# EasyEDA Pro project LUME_PEN_EasyEDA_Project_V1.2_2026-06-28.epro, board Charger_PCB
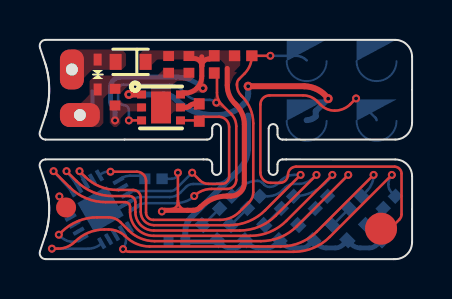
[diagram p5: board, top side]
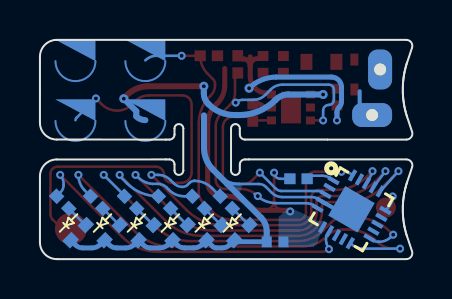
[diagram p6: board, bottom side, seen from below]

Outline 18.64 x 11 mm; copper layers: Top Layer, Bottom Layer. Coordinates in mm from the lower left corner of the outline.
Outline path: 0,4.61 arc(0.04,4.88) 0.28,5 8.37,5 arc(8.55,4.93) 8.63,4.75 8.63,4.44 arc(8.85,4.22) 9.07,4.44 9.07,6.55 arc(8.85,6.77) 8.63,6.55 8.63,6.25 arc(8.55,6.07) 8.37,6 0.28,6 arc(0.04,6.12) 0,6.39 0.25,7.15 0.27,7.2 0.29,7.25 0.3,7.31 0.32,7.36 0.33,7.41 0.34,7.47 0.36,7.52 0.37,7.58 0.38,7.63 0.39,7.69 0.4,7.74 0.41,7.8 0.43,7.91 0.43,7.97 0.44,8.02 0.45,8.08 0.45,8.14 0.45,8.19 0.46,8.25 0.46,8.3 0.46,8.36 0.46,8.42 0.47,8.47 0.47,8.53 0.46,8.59 0.46,8.64 0.46,8.7 0.46,8.75 0.45,8.81 0.45,8.87 0.45,8.92 0.44,8.98 0.43,9.03 0.43,9.09 0.41,9.2 0.4,9.26 0.39,9.31 0.38,9.37 0.37,9.42 0.36,9.48 0.34,9.53 0.33,9.59 0.32,9.64 0.3,9.7 0.29,9.75 0.27,9.8 0.25,9.86 0,10.6 arc(0.04,10.87) 0.29,11 17.8,11 arc(18.4,10.75) 18.64,10.15 18.64,6.84 arc(18.4,6.24) 17.8,6 12.34,6 12.16,6 arc(11.98,6.07) 11.9,6.25 11.9,6.55 arc(11.68,6.77) 11.46,6.55 11.46,4.44 arc(11.68,4.22) 11.9,4.44 11.9,4.75 arc(11.98,4.93) 12.16,5 12.34,5 17.8,5 arc(18.39,4.75) 18.64,4.15 18.64,0.85 arc(18.4,0.25) 17.8,0 17.72,0 0.29,0 arc(0.05,0.12) 0,0.39 0.25,1.14 0.27,1.19 0.29,1.25 0.3,1.3 0.32,1.35 0.33,1.41 0.34,1.46 0.36,1.52 0.37,1.57 0.38,1.63 0.39,1.68 0.4,1.74 0.41,1.79 0.43,1.91 0.43,1.96 0.44,2.02 0.45,2.07 0.45,2.13 0.45,2.19 0.46,2.24 0.46,2.3 0.46,2.35 0.46,2.41 0.47,2.47 0.47,2.52 0.46,2.58 0.46,2.63 0.46,2.69 0.46,2.75 0.45,2.8 0.45,2.86 0.45,2.91 0.44,2.97 0.43,3.03 0.43,3.08 0.41,3.19 0.4,3.25 0.39,3.31 0.38,3.36 0.37,3.42 0.36,3.47 0.34,3.53 0.33,3.58 0.32,3.64 0.3,3.69 0.29,3.74 0.27,3.8 0.25,3.85 0,4.61
Stack: Top Layer 0.035mm / Dielectric1 1.51mm FR4 er 4.5 / Bottom Layer 0.035mm

## Design rules (mm)
template: Custom Config
spacing copperThickness1oz (default): track to track 0.102, other pairs 0.13 to 0.3
spacing copperThickness2oz: track to track 0.203, other pairs 0.152 to 0.3
track width copperThickness1oz (default): min 0.127, default 0.127, max 2.54
track width copperThickness2oz: min 0.203, default 0.254, max 2.54
differential pair differentialPair (default): width min 0.127, default 0.254, max 2.54; gap min 0.152, default 0.152
via viaSize (default): diameter min 0.5, default 0.61, max 10; hole min 0.3, default 0.305, max 6.3

## Placement (name value [footprint] x y rotation side)
C1  100nF  [C0402]  7.46 9.77 270 top
C2  10µF  [C0402]  6.45 9.77 270 top
C3  100nF  [C0402]  6.86 0.87 0 bottom
C4  100nF  [C0402]  3.76 8.13 90 top
D3  RB520SM-40T2R  [SOD-523F_L1.7-W0.9-LS1.7-RD]  4.54 9.89 180 top
LED1  XL-1005URC  [LED0402-RD_YELLOW]  8.53 1.33 135 bottom
LED2  XL-1005UWC  [LED0402-RD_YELLOW]  9.92 1.33 135 bottom
LED3  XL-1005UWC  [LED0402-RD_YELLOW]  11.62 1.33 135 bottom
LED4  XL-1005UWC  [LED0402-RD_YELLOW]  13.32 1.33 135 bottom
LED5  XL-1005UWC  [LED0402-RD_YELLOW]  15.02 1.33 135 bottom
LED6  XL-1005UWC  [LED0402-RD_YELLOW]  16.72 1.33 135 bottom
NOREF  -  [Pad_e1018]  1.31 2.59 0 top
NOREF#2  -  [Pad_e237]  2 7.23 90 top
NOREF#3  -  [Pad_e236]  1.6 9.51 180 top
NOREF#4  -  [Pad_e68]  16.86 9.97 0 top
NOREF#5  -  [Pad_e559]  17.09 1.53 0 top
NOREF#6  -  [Pad_e69]  13.36 9.97 0 top
NOREF#7  -  [Pad_e71]  16.86 6.97 180 top
NOREF#8  -  [Pad_e70]  13.36 6.97 180 top
R1  100K  [R0402]  8.73 9.77 90 top
R2  20K  [R0402]  7.98 7.35 270 top
R3  10K  [R0402]  5.69 4.03 0 bottom
R4  330  [R0402]  9.31 2.85 225 bottom
R5  330  [R0402]  10.7 2.85 225 bottom
R6  330  [R0402]  12.4 2.85 225 bottom
R7  330  [R0402]  14.1 2.85 225 bottom
R8  330  [R0402]  15.8 2.85 225 bottom
R9  330  [R0402]  17.5 2.85 225 bottom
R10  20K  [R0402]  10.18 10.2 180 top
TVS1  LESD5D5.0CT1G  [SOD-523_L1.2-W0.8-LS1.6-BI]  2.89 9.26 90 top
U1  TPS2553DRVR-1  [WSON-6_L2.0-W2.0-P0.65-BL-EP]  6.07 7.61 270 top
U2  CH32V003F4U6  [QFN-20_L3.0-W3.0-P0.40-TL-EP1.7]  3.04 2.5 210 bottom

## Footprints (pads in the part's own frame, mm; a bottom-side part is the same pattern mirrored in y, then rotated)
C0402
  rect 0.5x0.54 smd: 1(-0.42,0) 2(0.42,0)
LED0402-RD_YELLOW
  rect 0.636x0.54 smd: 1(-0.538,0) 2(0.538,0)
Pad_e68
  custom 2x2.079 smd far side: 22(0,0)
Pad_e69
  custom 2x2.079 smd far side: 22(0,0)
Pad_e70
  custom 2x2.079 smd far side: 22(0,0)
Pad_e71
  custom 2x2.079 smd far side: 22(0,0)
Pad_e236
  rrect 1.2x2 hole 0.6: 1(0,0)
Pad_e237
  rrect 1.2x2 hole 0.6: 1(0,0)
Pad_e559
  round 1.6 smd: 1(0,0)
Pad_e1018
  round 1 smd: 1(0,0)
QFN-20_L3.0-W3.0-P0.40-TL-EP1.7
  rect 0.6x0.2 smd: 1(-1.5,0.8) 2(-1.5,0.401) 3(-1.5,0) 4(-1.5,-0.4) 5(-1.5,-0.8) 11(1.5,-0.8) 12(1.5,-0.4) 13(1.5,0) 14(1.5,0.401) 15(1.5,0.8)
  rect 0.2x0.6 smd: 6(-0.8,-1.5) 7(-0.4,-1.5) 8(0,-1.5) 9(0.4,-1.5) 10(0.799,-1.5) 16(0.8,1.5) 17(0.4,1.5) 18(0,1.5) 19(-0.4,1.5) 20(-0.8,1.5)
  rect 1.7x1.7 smd: 21(0,0)
R0402
  rect 0.566x0.54 smd: 1(-0.433,0) 2(0.433,0)
SOD-523_L1.2-W0.8-LS1.6-BI
  rect 0.6x0.4 smd: 1(-0.75,0) 2(0.75,0)
SOD-523F_L1.7-W0.9-LS1.7-RD
  rect 0.6x0.8 smd: 1(-0.75,0) 2(0.75,0)
WSON-6_L2.0-W2.0-P0.65-BL-EP
  rect 0.4x0.45 smd: 1(-0.65,-0.975) 2(0,-0.975) 3(0.65,-0.975) 4(0.65,0.975) 5(0,0.975) 6(-0.65,0.975)
  rect 1.6x1 smd: 7(0,0)

## Nets
5V_IN: D3.2 NOREF#3.1 TVS1.2
5V_POGO: NOREF#8.22 U1.1
5V_POGO_EN: R2.2 U1.4 U2.3
GND: C1.2 C2.2 C3.2 C4.2 LED1.1 LED2.1 LED3.1 LED4.1 LED5.1 LED6.1 NOREF#2.1 NOREF#4.22 R2.1 TVS1.1 U1.5 U1.7 U2.4 U2.21
VBUS: C1.1 C2.1 C3.1 C4.1 D3.1 R1.2 R3.2 R10.2 U1.2 U1.6 U2.6
LED_R: R4.1 U2.18
LED_W1: R9.1 U2.7
LED_W2: R5.1 U2.17
LED_W3: R6.1 U2.16
LED_W4: R7.1 U2.11
LED_W5: R8.1 U2.10
NFAULT: R1.1 U1.3 U2.5
SENSE: NOREF#6.22 R10.1 U2.20
SWIO: NOREF.1 U2.15
UPDI: NOREF#5.1 NOREF#7.22
$1N881: R3.1 U2.1
$1N1138: LED6.2 R9.2
$1N1214: LED2.2 R5.2
$1N1287: LED3.2 R6.2
$1N1360: LED4.2 R7.2
$1N1433: LED5.2 R8.2
$1N1609: LED1.2 R4.2

Pads without a net: U2 2 8 9 12 13 14 19

## Via types
v1: diameter 0.45, hole 0.2, Top Layer to Bottom Layer, 4 vias
v2: diameter 0.4, hole 0.2, Top Layer to Bottom Layer, 23 vias

## Routing (per net, layer and track width the routed paths; a pad name or vN(x,y) marks a point on that pad's centre or on a via; arc(x,y) is an arc through that point)
5V_POGO: length 13.6
  Top Layer w0.3: v1(10.43,8.67) 13.24,8.67 arc(13.91,8.5) v1(14.44,8.05) ; v1(4.46,8.26) U1.1
  Bottom Layer w0.3: v1(4.46,8.26) 6.19,8.26 arc(6.54,8.19) 6.84,7.99 6.86,7.97 arc(7.68,7.42) 8.65,7.23 8.9,7.23 arc(9.59,7.36) 10.18,7.76 10.23,7.8 arc(10.38,8.03) 10.43,8.3 v1(10.43,8.67) ; v1(14.44,8.05) 13.82,7.42 13.82,7.16 arc(13.61,7.02) NOREF#8.22
5V_POGO_EN: length 11
  Top Layer w0.127: v2(7.63,4.34) 8.01,3.95 arc(8.21,3.82) 8.44,3.77 9.12,3.77 arc(9.37,3.88) 9.48,4.14 9.48,6.62 arc(9.33,6.99) 8.96,7.14 8.18,7.14 ; U1.4 7.89,6.96 arc(7.94,6.95) R2.2
  Bottom Layer w0.127: v2(7.63,4.34) 6.82,3.53 arc(6.7,3.45) 6.56,3.42 4.74,3.42 arc(4.52,3.37) U2.3
GND: length 27.8
  Top Layer w0.254: R2.1 7.75,7.79 arc(7.61,7.76) 7.5,7.68 arc(7.41,7.63) 7.31,7.61 U1.5
  Bottom Layer w0.127: 8.65,3.77 7.67,3.77 arc(7.48,3.73) 7.32,3.62 7.03,3.33 arc(6.79,3.17) 6.5,3.11 5.04,3.11 arc(4.77,3.06) U2.4 ; 8.65,3.77 9.25,3.77 ; 8.65,3.77 arc(9.21,3.88) 9.68,4.2
  Bottom Layer w0.2: 2.62,8.42 2.62,7.73 2.81,7.55 ; U2.4 3.69,2.42
  Bottom Layer w0.24: C3.2 8.72,0.87 arc(8.82,0.89) LED1.1 9.14,0.72 arc(9.31,0.6) 9.51,0.56 9.82,0.56 arc(9.91,0.58) 9.99,0.63 LED2.1 10.51,0.74 arc(10.71,0.61) 10.94,0.56 11.4,0.56 arc(11.6,0.6) 11.77,0.71 LED3.1 12.21,0.74 arc(12.41,0.61) 12.64,0.56 13.1,0.56 arc(13.3,0.6) 13.47,0.71 LED4.1 13.91,0.74 arc(14.11,0.61) 14.34,0.56 14.8,0.56 arc(15,0.6) 15.17,0.71 LED5.1 15.61,0.74 arc(15.81,0.61) 16.04,0.56 16.5,0.56 arc(16.7,0.6) 16.87,0.71 LED6.1
  Bottom Layer w0.3: C3.2 7.28,1.38 arc(7.36,1.77) 7.58,2.09 9.97,4.48 arc(10.31,4.99) 10.43,5.58 10.43,7.21
VBUS: length 24.8
  Top Layer w0.127: v2(6.91,4.34) 6.91,2.93 ; 6.91,2.93 6.91,2.86 arc(6.81,2.61) 6.56,2.51 ; 6.91,2.93 arc(7.06,2.59) 7.4,2.45
  Top Layer w0.25: 7.14,8.33 7.3,8.33 arc(7.6,8.39) 7.85,8.56 arc(8.04,8.84) 8.11,9.17 ; 8.5,10.04 8.47,10.04 arc(8.21,9.94) 8.11,9.68 ; 8.11,9.68 8.11,9.2 ; 8.11,9.68 8.11,10.15 ; 8.11,9.68 arc(8,9.95) 7.73,10.06
  Top Layer w0.254: 9.39,9.56 9.39,8.71 arc(9.48,8.22) 9.76,7.81 9.84,7.73 arc(10.14,7.28) 10.24,6.75 10.24,3.84 arc(10.04,3.36) 9.56,3.16 9.36,3.16 arc(8.65,3.02) 8.06,2.62 8.03,2.6 arc(7.87,2.49) 7.67,2.45 6.25,2.45 arc(6.17,2.43) v2(6.11,2.39)
  Bottom Layer w0.127: R3.2 6.61,4.03 arc(6.82,4.12) v2(6.91,4.34)
  Bottom Layer w0.25: v2(3.76,6.96) 3.76,7.37 arc(3.74,7.5) 3.66,7.61 arc(3.57,7.75) 3.54,7.91 3.54,8.62 arc(3.68,8.98) 4.04,9.13 6.81,9.13 arc(7.54,8.98) v1(8.17,8.57)
LED_R: length 18.2
  Top Layer w0.127: v2(1.98,4.41) 2.26,4.14 arc(3,3.64) 3.87,3.47 4.67,3.47 arc(4.94,3.36) 5.05,3.09 5.05,2.37 arc(5.25,1.9) 5.72,1.7 9.48,1.7 arc(10.45,1.89) 11.28,2.44 v2(13.06,4.22)
  Bottom Layer w0.127: 9.61,3.15 10.02,3.56 arc(10.43,3.83) 10.9,3.92 10.91,3.92 arc(11.04,3.9) 11.15,3.83 11.24,3.73 arc(11.36,3.65) 11.5,3.62 arc(11.74,3.67) 11.94,3.8 12.1,3.97 arc(12.39,4.16) 12.73,4.22 v2(13.06,4.22) ; U2.18 1.98,4.33
LED_W1: length 17.2
  Top Layer w0.127: v2(17.63,4.22) 14.52,1.11 arc(13.69,0.56) 12.72,0.37 4.48,0.37 arc(4.31,0.4) v2(4.16,0.5)
  Bottom Layer w0.127: 17.81,3.15 17.61,3.35 arc(17.5,3.52) 17.46,3.72 17.46,3.75 arc(17.5,4) v2(17.63,4.22) ; U2.7 arc(4.29,1.13) 4.3,0.83 arc(4.24,0.66) v2(4.16,0.5)
LED_W2: length 19.3
  Top Layer w0.127: v2(1.33,4.41) 1.84,3.91 arc(2.66,3.36) 3.63,3.16 4.48,3.16 arc(4.69,3.07) 4.78,2.86 4.78,2.36 arc(5.05,1.7) 5.71,1.43 10.01,1.43 arc(10.98,1.63) 11.81,2.18 v2(13.85,4.22)
  Bottom Layer w0.127: U2.17 v2(1.33,4.41) ; 11.01,3.15 11.41,3.15 arc(11.82,3.23) 12.17,3.47 12.3,3.59 arc(12.5,3.73) 12.73,3.77 13,3.77 arc(13.46,3.91) 13.82,4.22
LED_W3: length 20.4
  Top Layer w0.127: v2(14.65,4.22) 12.34,1.91 arc(11.51,1.36) 10.54,1.17 5.71,1.17 arc(4.86,1.52) 4.52,2.36 4.52,2.62 arc(4.45,2.79) 4.28,2.86 3.29,2.86 arc(2.32,3.05) 1.49,3.6 v2(0.68,4.41)
  Bottom Layer w0.127: U2.16 v2(0.68,4.41) ; 14.63,4.22 14.63,4.15 14.29,3.81 arc(13.56,3.32) 12.71,3.15
LED_W4: length 19.4
  Top Layer w0.127: v2(0.95,1.22) 1.07,1.35 arc(1.9,1.9) 2.87,2.1 3.43,2.1 arc(3.76,2.03) 4.04,1.84 4.45,1.44 arc(5.04,1.04) 5.75,0.9 11.07,0.9 arc(12.04,1.09) 12.87,1.64 v2(15.44,4.22)
  Bottom Layer w0.127: 14.41,3.15 14.41,3.19 v2(15.44,4.22) arc(15.5,4.18) 15.58,4.19 ; v2(0.95,1.22) 1.05,1.12 arc(1.33,0.93) 1.66,0.87 1.68,0.87 arc(1.93,0.92) U2.11
LED_W5: length 21.8
  Top Layer w0.127: v2(0.6,0.52) 0.91,0.52 arc(1.37,0.62) 1.76,0.88 arc(2.43,1.33) 3.23,1.49 3.44,1.49 arc(3.9,1.39) 4.3,1.13 arc(4.85,0.76) 5.5,0.63 12.07,0.63 arc(13.04,0.83) 13.87,1.38 v2(16.72,4.22)
  Bottom Layer w0.127: 16.11,3.15 16.42,3.47 arc(16.64,3.82) v2(16.72,4.22) ; 2.43,0.52 v2(0.6,0.52) ; 3.09,0.8 arc(2.79,0.6) 2.43,0.53
NFAULT: length 19.6
  Top Layer w0.127: U1.3 v2(4.46,6.96) ; R1.1 arc(8.83,9.29) 8.87,9.2 8.87,8.35 arc(8.94,8.01) 9.12,7.73 9.58,7.28 arc(9.77,6.99) 9.84,6.66 9.84,3.98 arc(9.7,3.65) 9.38,3.52 8.59,3.52 arc(8.12,3.43) v2(7.73,3.16)
  Bottom Layer w0.127: v2(7.73,3.16) 7.83,3.26 7.88,3.26 arc(7.37,2.92) 6.78,2.81 5.34,2.81 arc(5.01,2.74) U2.5 ; v2(4.46,6.96) 4.46,7.45 arc(4.37,7.65) 4.17,7.73 arc(3.99,7.81) 3.92,7.99 3.92,8.5 arc(3.99,8.68) 4.17,8.75 6.5,8.75 arc(6.81,8.69) 7.08,8.51 7.35,8.24 arc(7.63,8.05) 7.96,7.99 8.5,7.99 arc(8.68,7.95) v2(8.84,7.85)
SENSE: length 20.6
  Top Layer w0.127: v2(3.54,4.38) 4.86,4.38 arc(5.18,4.25) 5.32,3.92 5.32,2.33 arc(5.42,2.07) 5.68,1.97 9.02,1.97 arc(9.55,2.07) 10,2.37 10.48,2.86 arc(10.63,3.08) 10.69,3.35 10.69,6.81 arc(10.54,7.54) 10.13,8.16 10.09,8.2 arc(9.93,8.44) 9.87,8.72 9.87,8.78 arc(9.9,8.91) 9.97,9.03 10.24,9.3 arc(10.52,9.71) R10.1 v2(11.54,10.2)
  Bottom Layer w0.127: v2(11.54,10.2) 12.81,10.2 arc(13.11,10.14) NOREF#6.22 ; U2.20 arc(3.24,4.36) v2(3.54,4.38)
SWIO: length 0.8
  Bottom Layer w0.127: U2.15 1.21,2.57 arc(1.04,2.83) v2(0.97,3.14)
UPDI: length 21.1
  Top Layer w0.127: v2(15.84,8.06) 15.55,7.77 arc(15.19,7.53) 14.77,7.45 arc(14.39,7.52) 14.07,7.73 13.89,7.92 arc(13.56,8.14) 13.18,8.21 11.5,8.21 arc(11.18,8.08) 11.04,7.75 11.04,4.34 arc(11.2,3.98) 11.56,3.82 12.02,3.82 arc(12.31,3.94) 12.43,4.23 arc(12.55,4.52) 12.83,4.64 17.76,4.64 arc(18.01,4.53) 18.12,4.28 18.12,2.25 arc(18.09,2.11) 18.01,1.99 17.76,1.74
  Bottom Layer w0.127: v2(15.84,8.06) 16.82,7.08 arc(16.85,7.03) NOREF#7.22
$1N881: length 1.4
  Bottom Layer w0.127: U2.1 arc(4.2,4.12) 4.52,4.18 5.14,4.18 arc(5.19,4.19) 5.23,4.22
$1N1138: length 1.2
  Bottom Layer w0.127: 17.19,2.54 16.38,1.72 arc(16.36,1.71) LED6.2
$1N1214: length 1.2
  Bottom Layer w0.127: 10.4,2.54 9.58,1.72 arc(9.56,1.71) LED2.2
$1N1287: length 1.2
  Bottom Layer w0.127: 12.09,2.54 11.28,1.72 arc(11.26,1.71) LED3.2
$1N1360: length 1.2
  Bottom Layer w0.127: R7.2 12.98,1.72 arc(12.96,1.71) LED4.2
$1N1433: length 1.2
  Bottom Layer w0.127: 15.5,2.54 14.68,1.72 arc(14.66,1.71) LED5.2
$1N1609: length 1.2
  Bottom Layer w0.127: R4.2 8.19,1.72 arc(8.17,1.71) 8.15,1.71

## Copper pours and planes (outline as drawn; the poured copper is in the pictures)
5V_IN on Top Layer: 1.32,10.51 4.31,10.51 4.31,8.99 1.32,8.99
GND on Top Layer: 1.64,9.51 7.73,9.51 7.73,6.62 1.64,6.62
GND on Bottom Layer: 8.77,3.28 8.68,3.14 8.54,3.05
GND on Bottom Layer: -0.33,11.93 21.7,11.93 21.7,5.87 -0.33,5.87
VBUS on Top Layer: 3.5,7.95 5.29,7.95 5.29,6.63 3.5,6.63
VBUS on Top Layer: 5,10.47 10.03,10.47 10.03,9.2 5,9.2
VBUS on Bottom Layer: 4.42,2.57 6.69,2.57 6.69,0.6 4.42,0.6

Small or netless copper shapes (teardrops, artwork), in the pictures only: 4 on Top Layer, 1 on Bottom Layer
